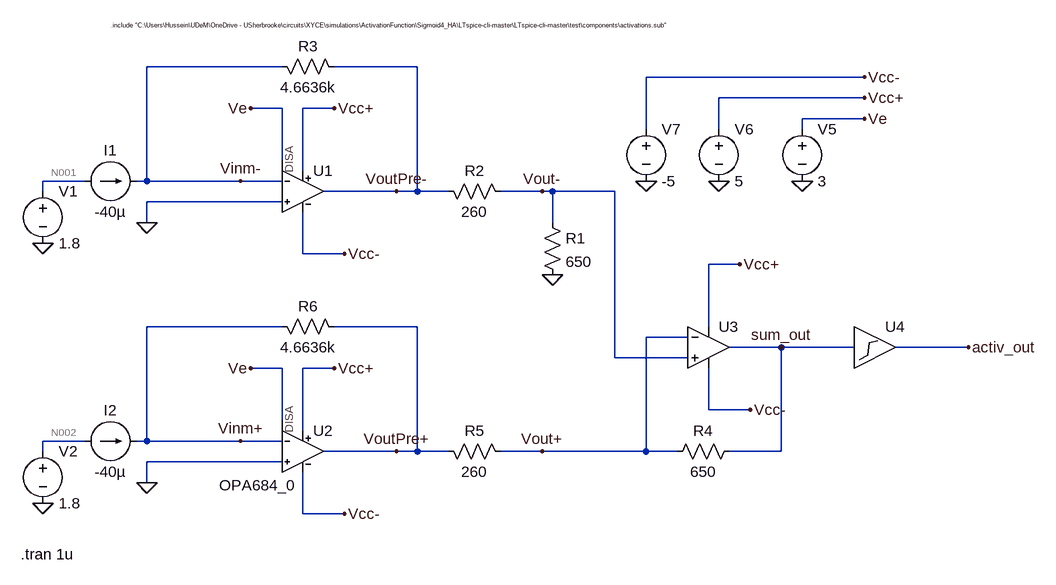
[diagram p0: schematic Draft1.asc]
Draft1.asc, the LTspice schematic file:
Version 4
SHEET 1 2360 680
WIRE 160 -128 -48 -128
WIRE 368 -128 240 -128
WIRE 1056 -112 720 -112
WIRE 1056 -80 832 -80
WIRE 160 -64 112 -64
WIRE 240 -64 192 -64
WIRE 1056 -48 960 -48
WIRE 720 -32 720 -112
WIRE 832 -32 832 -80
WIRE 960 -32 960 -48
WIRE 160 16 160 -64
WIRE 192 32 192 -64
WIRE -144 48 -208 48
WIRE -48 48 -48 -128
WIRE -48 48 -64 48
WIRE 96 48 -48 48
WIRE 160 48 96 48
WIRE -208 64 -208 48
WIRE 336 64 224 64
WIRE 368 64 368 -128
WIRE 368 64 336 64
WIRE 416 64 368 64
WIRE 560 64 496 64
WIRE 576 64 560 64
WIRE 672 64 576 64
WIRE 160 80 -48 80
WIRE -48 112 -48 80
WIRE 576 112 576 64
WIRE 192 160 192 96
WIRE 256 160 192 160
WIRE 864 176 816 176
WIRE 160 272 -48 272
WIRE 368 272 240 272
WIRE 816 272 816 176
WIRE 784 288 720 288
WIRE 928 304 848 304
WIRE 1040 304 928 304
WIRE 1216 304 1104 304
WIRE 672 320 672 64
WIRE 784 320 672 320
WIRE 160 336 112 336
WIRE 240 336 192 336
WIRE 816 400 816 336
WIRE 880 400 816 400
WIRE 160 416 160 336
WIRE 192 432 192 336
WIRE -144 448 -208 448
WIRE -48 448 -48 272
WIRE -48 448 -64 448
WIRE 96 448 -48 448
WIRE 160 448 96 448
WIRE -208 464 -208 448
WIRE 336 464 224 464
WIRE 368 464 368 272
WIRE 368 464 336 464
WIRE 416 464 368 464
WIRE 560 464 496 464
WIRE 720 464 720 288
WIRE 720 464 560 464
WIRE 768 464 720 464
WIRE 928 464 928 304
WIRE 928 464 848 464
WIRE 160 480 -48 480
WIRE -48 512 -48 480
WIRE 192 560 192 496
WIRE 256 560 192 560
FLAG -48 112 0
FLAG -208 144 0
FLAG 576 192 0
FLAG 560 64 Vout-
FLAG 336 64 VoutPre-
FLAG 96 48 Vinm-
FLAG 960 48 0
FLAG 832 48 0
FLAG 720 48 0
FLAG 1056 -112 Vcc-
FLAG 1056 -80 Vcc+
FLAG 1056 -48 Ve
FLAG 240 -64 Vcc+
FLAG 256 160 Vcc-
FLAG 112 -64 Ve
FLAG -48 512 0
FLAG -208 544 0
FLAG 560 464 Vout+
FLAG 336 464 VoutPre+
FLAG 96 448 Vinm+
FLAG 240 336 Vcc+
FLAG 256 560 Vcc-
FLAG 112 336 Ve
FLAG 880 400 Vcc-
FLAG 864 176 Vcc+
FLAG 928 304 sum_out
FLAG 1216 304 activ_out
SYMBOL res 560 96 R0
SYMATTR InstName R1
SYMATTR Value 650
SYMBOL res 512 80 M270
WINDOW 0 32 56 VTop 2
WINDOW 3 0 56 VBottom 2
SYMATTR InstName R2
SYMATTR Value 260
SYMBOL res 256 -112 M270
WINDOW 0 32 56 VTop 2
WINDOW 3 0 56 VBottom 2
SYMATTR InstName R3
SYMATTR Value 4.6636k
SYMBOL current -144 48 M90
WINDOW 0 -32 40 VBottom 2
WINDOW 3 32 40 VTop 2
WINDOW 123 0 0 Left 0
WINDOW 39 0 0 Left 0
SYMATTR InstName I1
SYMATTR Value -40µ
SYMBOL voltage -208 48 R0
WINDOW 123 0 0 Left 0
WINDOW 39 0 0 Left 0
SYMATTR InstName V1
SYMATTR Value 1.8
SYMBOL MySym\\opamp2_custom 192 0 R0
WINDOW 3 16 96 Invisible 2
SYMATTR InstName U1
SYMATTR Value ""
SYMATTR SpiceModel OPA684_0
SYMBOL voltage 960 -48 R0
WINDOW 123 0 0 Left 0
WINDOW 39 0 0 Left 0
SYMATTR InstName V5
SYMATTR Value 3
SYMBOL voltage 832 -48 R0
WINDOW 123 0 0 Left 0
WINDOW 39 0 0 Left 0
SYMATTR InstName V6
SYMATTR Value 5
SYMBOL voltage 720 -48 R0
WINDOW 123 0 0 Left 0
WINDOW 39 0 0 Left 0
SYMATTR InstName V7
SYMATTR Value -5
SYMBOL res 864 448 R90
WINDOW 0 0 56 VBottom 2
WINDOW 3 32 56 VTop 2
SYMATTR InstName R4
SYMATTR Value 650
SYMBOL res 512 480 M270
WINDOW 0 32 56 VTop 2
WINDOW 3 0 56 VBottom 2
SYMATTR InstName R5
SYMATTR Value 260
SYMBOL res 256 288 M270
WINDOW 0 32 56 VTop 2
WINDOW 3 0 56 VBottom 2
SYMATTR InstName R6
SYMATTR Value 4.6636k
SYMBOL current -144 448 M90
WINDOW 0 -32 40 VBottom 2
WINDOW 3 32 40 VTop 2
WINDOW 123 0 0 Left 0
WINDOW 39 0 0 Left 0
SYMATTR InstName I2
SYMATTR Value -40µ
SYMBOL voltage -208 448 R0
WINDOW 123 0 0 Left 0
WINDOW 39 0 0 Left 0
SYMATTR InstName V2
SYMATTR Value 1.8
SYMBOL MySym\\opamp2_custom 192 400 R0
WINDOW 3 16 96 Invisible 2
WINDOW 38 -129 116 Left 2
SYMATTR InstName U2
SYMATTR Value ""
SYMATTR SpiceModel OPA684_0
SYMBOL OpAmps\\opamp2 816 240 R0
WINDOW 3 16 96 Invisible 2
SYMATTR InstName U3
SYMATTR Value ""
SYMATTR SpiceModel MAX4223
SYMBOL MySym\\activ 1072 240 R0
WINDOW 3 10 86 Invisible 2
SYMATTR InstName U4
SYMATTR Value ""
SYMATTR SpiceModel ReLU
TEXT -104 -192 Left 0 !.include "C:\\Users\\Hussein\\UDeM\\OneDrive - USherbrooke\\circuits\\XYCE\\simulations\\ActivationFunction\\Sigmoid4_HA\\LTspice-cli-master\\LTspice-cli-master\\test\\components\\activations.sub"
TEXT -242 622 Left 2 !.tran 1u

The netlist it stands for:
* Draft1.asc
R1 Vout- 0 650
R2 Vout- VoutPre- 260
R3 VoutPre- Vinm- 4.6636k
I1 N001 Vinm- -40µ
V1 N001 0 1.8
XU1 0 Vinm- Vcc+ Vcc- VoutPre- Ve OPA684_0  ; pins In+ In- V+ V- OUT DISA
V5 Ve 0 3
V6 Vcc+ 0 5
V7 Vcc- 0 -5
R4 sum_out Vout+ 650
R5 Vout+ VoutPre+ 260
R6 VoutPre+ Vinm+ 4.6636k
I2 N002 Vinm+ -40µ
V2 N002 0 1.8
XU2 0 Vinm+ Vcc+ Vcc- VoutPre+ Ve OPA684_0  ; pins In+ In- V+ V- OUT DISA
XU3 Vout- Vout+ Vcc+ Vcc- sum_out MAX4223  ; pins In+ In- V+ V- OUT
XU4 sum_out activ_out ReLU  ; pins In OUT
.include "C:\Users\Hussein\UDeM\OneDrive - USherbrooke\circuits\XYCE\simulations\ActivationFunction\Sigmoid4_HA\LTspice-cli-master\LTspice-cli-master\test\components\activations.sub"
.tran 1u
.backanno
.end

* Results of the author's LTspice run, read from the files saved beside the schematic
* Operating Point, zero values left out:
*   V(vout-) = 143.8 mV
*   V(voutpre-) = 202.3 mV
*   V(vinm-) = -428.7 µV
*   V(n001) = 1.8 V
*   V(ve) = 3 V
*   V(vcc-) = -5 V
*   V(vcc+) = 5 V
*   V(sum_out) = -5.883 mV
*   V(vout+) = 143.5 mV
*   V(voutpre+) = 202.3 mV
*   V(vinm+) = -428.7 µV
*   V(n002) = 1.8 V
*   V(activ_out) = 3.035 mV
*   I(I1) = -40 µA
*   I(I2) = -40 µA
*   I(R1) = 221.3 µA
*   I(R2) = -224.8 µA
*   I(R3) = 43.47 µA
*   I(R4) = -229.7 µA
*   I(R5) = -226.3 µA
*   I(R6) = 43.47 µA
*   I(V1) = 40 µA
*   I(V5) = -5.606 nA
*   I(V6) = -6.705 mA
*   I(V7) = 4.553 mA
*   I(V2) = 40 µA